# EAGLE design rw-linear-17mm-mk-1.1 (EAGLE 7.5.0)
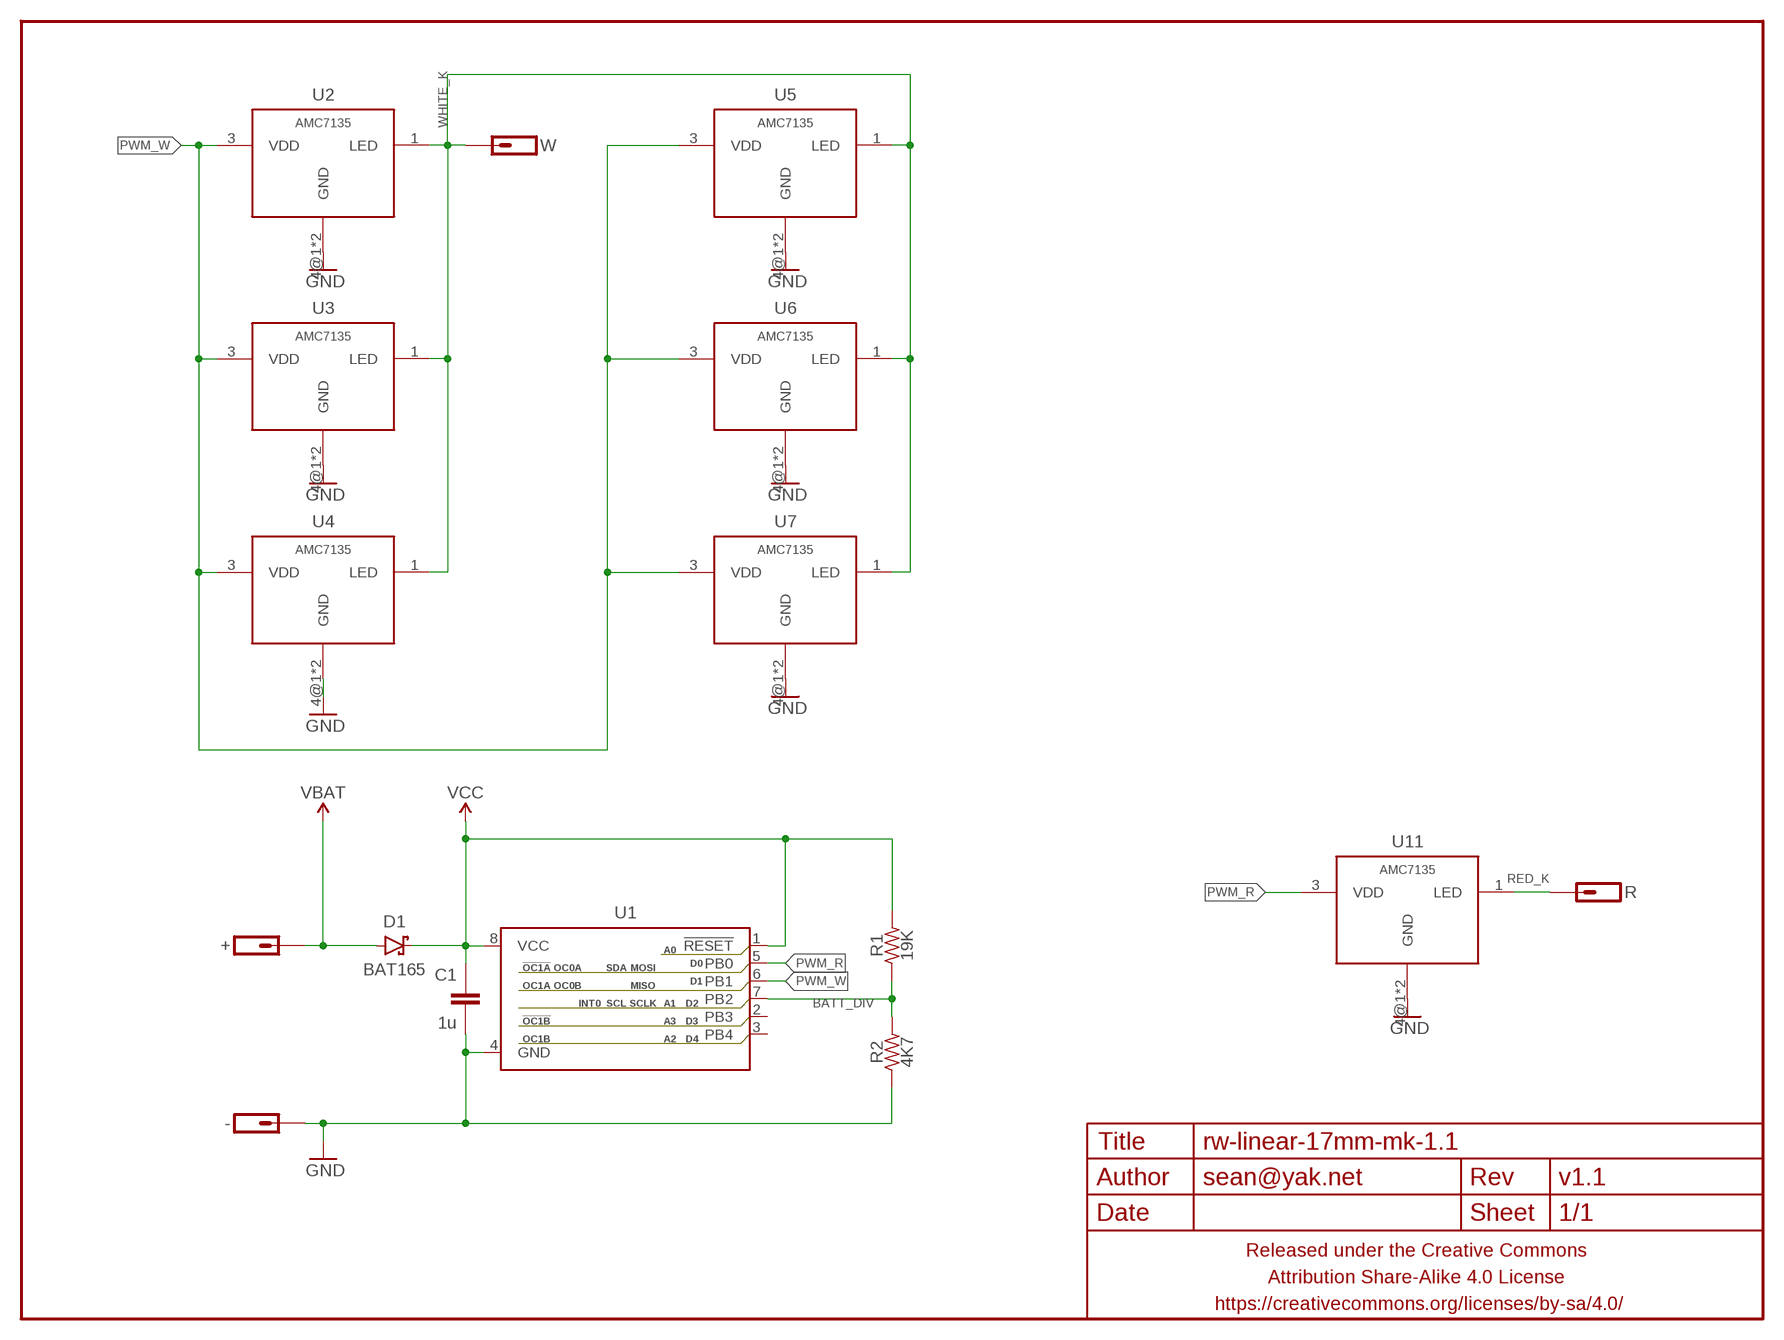
[diagram p0: schematic, sheet 1]

## Parts
+  M01PTH-1.2MM-NS  [1X01-1.2MM-NS]
-  M01NOT-A-VIA-NOPE  [1X01_NOSILK_NOSTOP]
C1  1u  CAPACITOR-CERAMICC0402  [C0402]
D1  BAT165  DIODE-SCHOTTKYSOD323  [SOD323-SCHOTTKY]
FRAME1  FRAME-LETTERNO_PACKAGE  [DUMMY]
R  M01SMD-1.25MM-DIA  [1X01-SMD-1.25MM-DIA-NS]
R1  19K  RESISTORR0402  [R0402]
R2  4K7  RESISTORR0402  [R0402]
U1  ATTINY13SOIC-NARROWPADS  [SO08-NARROWER]
U2  AMC7135  AMC7135SOT-89-NOTHERM  [SOT89-NOTHERM]
U3  AMC7135  AMC7135SOT-89-NOTHERM  [SOT89-NOTHERM]
U4  AMC7135  AMC7135SOT-89-NOTHERM  [SOT89-NOTHERM]
U5  AMC7135  AMC7135SOT-89-NOTHERM  [SOT89-NOTHERM]
U6  AMC7135  AMC7135SOT-89-NOTHERM  [SOT89-NOTHERM]
U7  AMC7135  AMC7135SOT-89-NOTHERM  [SOT89-NOTHERM]
U11  AMC7135  AMC7135SOT-89-NOTHERM  [SOT89-NOTHERM]
W  M01PTH-1MM-CIR-NS  [1X01-1MM-CIR-NS]

## Nets
BATT_DIV: R1.1 R2.2 U1.7(PB2)
GND: -.P$1 C1.2 R2.1 U1.4(GND) U2.4@1(GND) U2.4@2(GND) U3.4@1(GND) U3.4@2(GND) U4.4@1(GND) U4.4@2(GND) U5.4@1(GND) U5.4@2(GND) U6.4@1(GND) U6.4@2(GND) U7.4@1(GND) U7.4@2(GND) U11.4@1(GND) U11.4@2(GND)
PWM_R: U1.5(PB0) U11.3(VDD)
PWM_W: U1.6(PB1) U2.3(VDD) U3.3(VDD) U4.3(VDD) U5.3(VDD) U6.3(VDD) U7.3(VDD)
RED_K: R.P$1 U11.1(LED)
VBAT: +.P$1 D1.A
VCC: C1.1 D1.C R1.2 U1.1(!RESET) U1.8(VCC)
WHITE_K: U2.1(LED) U3.1(LED) U4.1(LED) U5.1(LED) U6.1(LED) U7.1(LED) W.1
Unconnected: U1.2(PB3) U1.3(PB4)

## Library data of the parts
+ - R W = a_parts:M01: Header 1 Standard 1-pin 0.1" header. Use with straight break away headers (SKU : PRT-00116), right angle break away headers (PRT-00553), swiss pins (PRT-00743), machine pins (PRT-00117), and female headers (PRT-00115).
C1 = a_parts:CAPACITOR-CERAMIC: CAPACITOR, European symbol
D1 = a_parts:DIODE-SCHOTTKY: Schottky diodes in SFE's production catalog BAT20J 1A 23V 0.62Vf RB751 120mA 40V 0.37Vf PMEG4005EJ 0.5A 40V 0.42Vf MBRA140 1A 40V 0.5Vf B340A 3A 40V SMA
FRAME1 = a_parts:FRAME-LETTER: Schematic Frame Standard 8.5x11 US Letter frame; DESIGNER: sean@yak.net; VERSION: v1.1
R1 R2 = a_parts:RESISTOR: RESISTOR, American symbol
U1 = a_parts:ATTINY13: Atmel 8-pin 1kB flash uC
U2-U7 U11 = a_parts:AMC7135

## Board
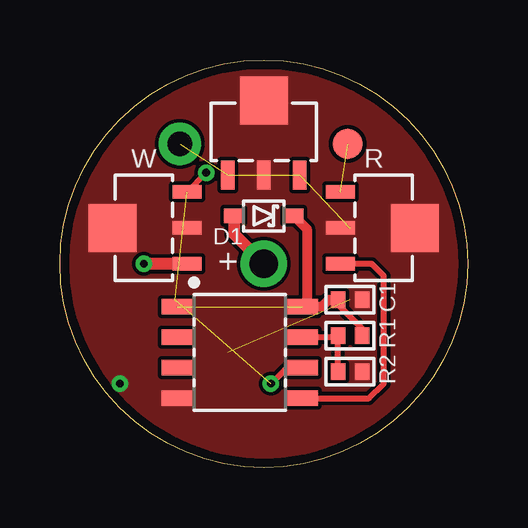
[diagram p1: board, top side]
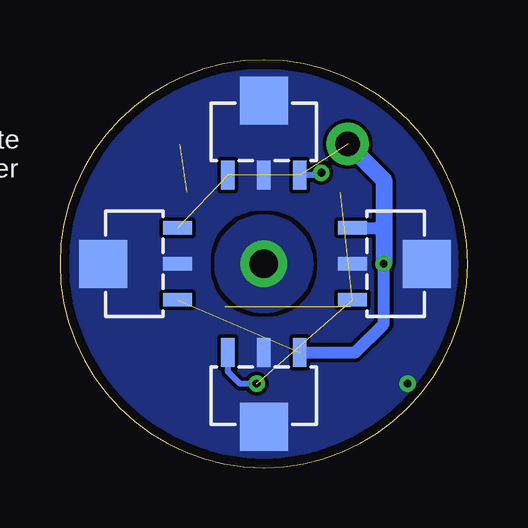
[diagram p2: board, bottom side, seen from below]

Size 17 x 17 mm. Coordinates in mm from the lower left corner, seen from the top.
Outline: 0,8.5 arc-180 17,8.5 arc-180 0,8.5
Copper layers (1*16): Top 0.0356mm / dielectric 1.5011mm / Bottom 0.0356mm
Design rules "LaenPCBOrder2": minimum track width 6mil, minimum drill 13mil, track to track 6mil, track to pad 6mil, pad to pad 6mil, via to via 6mil, smd to smd 6mil, copper to edge 15mil, drill to drill 6mil, minimum pad ring 7mil, minimum via ring 7mil, stop-mask expansion 3mil, vias tented up to drill 20mil, thermal gap 10mil

### Footprints (pad centres in the part's own frame; a part is rotated, then mirrored left to right if it is on the bottom)
1X01-1.2MM-NS = drill 1.2 pad 1.93: P$1 0,0
1X01_NOSILK_NOSTOP = drill 0.33: P$1 0,0
C0402 = smd 0.6 x 0.7: 1 -0.5,0; 2 0.5,0
SOD323-SCHOTTKY = smd 0.8 x 0.6: A -1.25,0; C 1.25,0
1X01-SMD-1.25MM-DIA-NS = smd 1.25 x 1.25: P$1 0,0
R0402 = smd 0.6 x 0.7: 1 -0.5,0; 2 0.5,0
SO08-NARROWER = smd 0.635 x 1.27: 1 -1.905,-2.616; 2 -0.635,-2.616; 3 0.635,-2.616; 4 1.905,-2.616; 5 1.905,2.616; 6 0.635,2.616; 7 -0.635,2.616; 8 -1.905,2.616
SOT89-NOTHERM = smd 0.58 x 1.2: 1 -1.5,-1.8; 3 1.5,-1.8; 4@1 0,-1.8 | smd 2 x 2: 4@2 0,1.3
1X01-1MM-CIR-NS = drill 1.016 pad 1.778: 1 0,0

### Placement (x,y rotation side)
+  8.5,8.5 90 top
-  2.5,3.5 90 bottom
C1  12.1,7 0 top
D1  8.5,10.5 0 top
FRAME1  0,0 0 top
R  12,13.5 0 top
R1  12.1,5.5 0 top
R2  12.1,4 180 top
U1  7.5,4.8 270 top
U2  3.5,10 90 top
U3  3,8.5 270 bottom
U4  8.5,3 180 bottom
U5  13.9,8.5 90 bottom
U6  8.5,14 0 top
U7  8.5,14 0 bottom
U11  13.5,10 270 top
W  5,13.5 270 top

### Tracks (layer width: path | path; a pad name or v marks a point on that pad's centre or on a via)
BATT_DIV
  Top 0.25: U1.7 11.54,5.43 R1.1 R2.2
GND
  pour Top (isolate 0.152, rank 6, no thermals): 0,0 17,0 17,17 0,17
  pour Bottom (isolate 0.152, rank 6, no thermals): 17,0 0,0 0,17 17,17
PWM_R
  Top 0.25: U1.5 12.89,2.9 13.5,3.5 13.5,8 13,8.5 U11.3
PWM_W  (via drill 0.33)  (4 unrouted)
  Top 0.25: U1.6 9.46,4.17 v8.8,3.5 | U2.3 v6.1,12.3
  Bottom 0.25: v8.8,3.5 9.5,3.5 10,4 U4.3 | v6.1,12.3 6.2,12.2 U7.3
RED_K  (1 unrouted)
VBAT
  Top 0.5: D1.A 7.25,9.75 +.P$1
  pour Bottom (isolate 0.152, no thermals): 6.5,8.5 arc-180 10.5,8.5 arc-180
VCC  (1 unrouted)
  Top 0.25: C1.1 11.6,6.8 12.6,5.8 R1.2
  Top 0.406: D1.C 10.3,9.95 10.3,6.89 U1.8 10.9,6.71 11.2,7 C1.1
WHITE_K  (via drill 0.33)  (3 unrouted)
  Top 0.5: U2.1 v3.5,8.5
  Bottom 0.5: 3.5,9.5 v3.5,8.5 3.5,6 4.7,4.8 U4.1 | U3.1 3.5,10
  Bottom 0.7: W.1 3.5,12 3.5,10 v3.5,8.5

### Text on the board
bPlace: Red+White / LED Driver